# Altium schematic sheet LEDs.SchDoc
size A
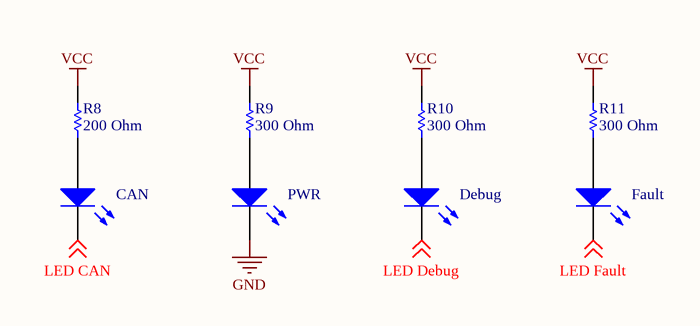
[diagram p0: LEDs.SchDoc]

## Parts
CAN  LED  [0805_A]  (value not drawn)
Debug  LED  [0805_A]  (value not drawn)
Fault  LED  [0805_A]  (value not drawn)
PWR  LED  [0805_A]  (value not drawn)
R8  200 Ohm  [RESC0805(2012)_N]
R9  300 Ohm  [RESC0805(2012)_N]
R10  300 Ohm  [RESC0805(2012)_N]
R11  300 Ohm  [RESC0805(2012)_N]

## Nets
GND: PWR.1(K)
VCC: R8.1 R9.1 R10.1 R11.1
LED CAN: CAN.1(K) ; off-sheet LED CAN
LED Debug: Debug.1(K) ; off-sheet LED Debug
LED Fault: Fault.1(K) ; off-sheet LED Fault
NetCAN_2: CAN.2(A) R8.2
NetDebug_2: Debug.2(A) R10.2
NetFault_2: Fault.2(A) R11.2
NetPWR_2: PWR.2(A) R9.2

## Notes on the sheet
- Title
- Size:
- Date:
- A
- Number:
- Time:
- Revision:
- Sheet
- of
- File:

## Library data of the parts
CAN Fault = LED: Standard 0805 LED; Manufacturer: Wuerth Elektronik; PartNumber: 150080SS75000; PackageReference: 0805_A
  CAN: Color: Blue
  Fault: ComponentLink2URL: http://katalog.we-online.com/led/datasheet/150080SS75000.pdf; ComponentLink1URL: http://www.we-online.com; Color: Super Red; ComponentLink2Description: Datasheet; ComponentLink1Description: Manufacturer URL
Debug PWR = LED: Standard 0805 LED; PackageReference: 0805_A
  Debug: Color: Green
  PWR: Color: Yellow
R8-R11 = Resistor 0805: Generic 0805 Resistor; Value: 120R; Case-EIA: 0805; Tolerance: 5 %; Case-Metric: 2012; Power: 0.125 W; Technology: SMT